# Altium schematic sheet CLK_CDCI6214.SchDoc
size A3; DocumentNumber: 1; SheetNumber: 1; SheetTotal: 5
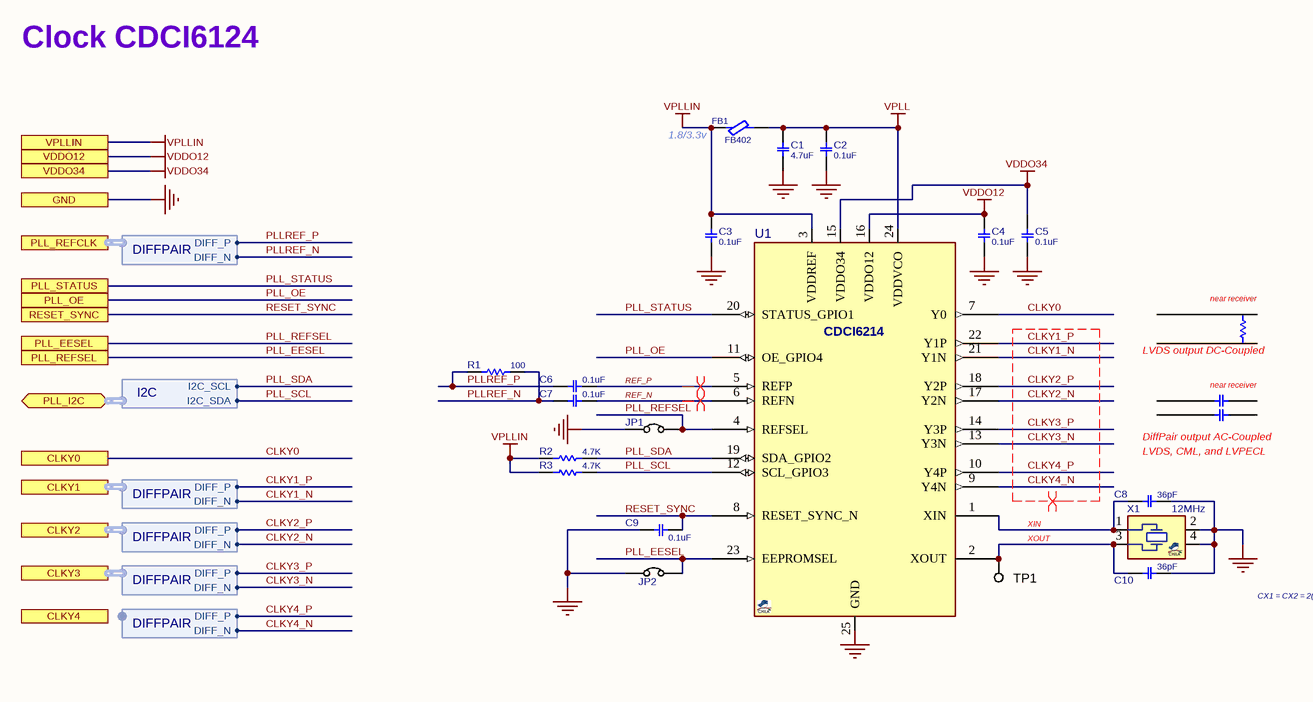
[diagram p0: CLK_CDCI6214.SchDoc]

## Parts
C1  4.7uF  [C0402]
C2  0.1uF  [C0402]
C3  0.1uF  [C0402]
C4  0.1uF  [C0402]
C5  0.1uF  [C0402]
C6  0.1uF  [C0402]
C7  0.1uF  [C0402]
C8  36pF  [C0402]
C9  0.1uF  [C0402]
C10  36pF  [C0402]
FB1  FB402  [L0402]
JP1  JMPSOLDER  [JP_40X50]  (value not drawn)
JP2  JMPSOLDER  [JP_40X50]  (value not drawn)
R1  100  [R0402]
R2  4.7K  [R0402]
R3  4.7K  [R0402]
TP1  TESTPOINT_M_GRN  [TPSMD_C60]  (value not drawn)  (no BOM)
U1  CDCI6214  [QFN50_24T]  (value not drawn)
X1  12MHz  [XTL_4_2520]

## Ports
CLKY0, CLKY1 (harness DIFFPAIR), CLKY2 (harness DIFFPAIR), CLKY3 (harness DIFFPAIR), CLKY4 (harness DIFFPAIR), GND, PLL_EESEL, PLL_I2C (bidir, harness I2C), PLL_OE, PLL_REFCLK (harness DIFFPAIR), PLL_REFSEL, PLL_STATUS, RESET_SYNC, VDDO12, VDDO34, VPLLIN

## Harnesses
DIFFPAIR: DIFF_N, DIFF_P
I2C: I2C_SCL, I2C_SDA

## Nets
GND: C1.2 C2.2 C3.2 C4.2 C5.2 C8.1 C9.2 C10.1 JP1.1 JP2.1 U1.25(GND) X1.2 X1.4 ; port GND
VDDO12: C4.1 U1.16(VDDO12) ; port VDDO12
VDDO34: C5.1 U1.15(VDDO34) ; port VDDO34
VPLL: C1.1 C2.1 FB1.2 U1.24(VDDVCO)
VPLLIN: C3.1 FB1.1 R2.1 R3.1 U1.3(VDDREF) ; port VPLLIN
CLKY0: U1.7(Y0) ; port CLKY0
CLKY1_N: U1.21(Y1N) ; port CLKY1.DIFF_N
CLKY1_P: U1.22(Y1P) ; port CLKY1.DIFF_P
CLKY2_N: U1.17(Y2N) ; port CLKY2.DIFF_N
CLKY2_P: U1.18(Y2P) ; port CLKY2.DIFF_P
CLKY3_N: U1.13(Y3N) ; port CLKY3.DIFF_N
CLKY3_P: U1.14(Y3P) ; port CLKY3.DIFF_P
CLKY4_N: U1.9(Y4N) ; harness DIFFPAIR.DIFF_N
CLKY4_P: U1.10(Y4P) ; harness DIFFPAIR.DIFF_P
PLL_EESEL: JP2.2 U1.23(EEPROMSEL) ; port PLL_REFSEL
PLL_OE: U1.11(OE_GPIO4) ; port PLL_OE
PLL_REFSEL: JP1.2 U1.4(REFSEL) ; port PLL_EESEL
PLL_SCL: R3.2 U1.12(SCL_GPIO3) ; port PLL_I2C.I2C_SDA
PLL_SDA: R2.2 U1.19(SDA_GPIO2) ; port PLL_I2C.I2C_SCL
PLL_STATUS: U1.20(STATUS_GPIO1) ; port PLL_STATUS
PLLREF_N: C7.2 R1.1 ; port PLL_REFCLK.DIFF_N
PLLREF_P: C6.2 R1.2 ; port PLL_REFCLK.DIFF_P
REF_N: C7.1 U1.6(REFN)
REF_P: C6.1 U1.5(REFP)
RESET_SYNC: C9.1 U1.8(RESET_SYNC_N) ; port RESET_SYNC
XIN: C8.2 U1.1(XIN) X1.1
XOUT: C10.2 TP1.1 U1.2(XOUT) X1.3

## Layout directives
differential pair: CLKY1_N, CLKY1_P, CLKY2_N, CLKY2_P, CLKY3_N, CLKY3_P, CLKY4_N, CLKY4_P, REF_N, REF_P

## Notes on the sheet
- Clock CDCI6124
- (near FB1) 1.8/3.3v
- near receiver
- LVDS output DC-Coupled
- DiffPair output AC-Coupled
- (near C8) LVDS, CML, and LVPECL
- (near C10) CX1 = CX2 = 2(CL - Cstray), CS=2pF, CL=20pF

## Library data of the parts
C1 = CAP_SMD_MLCC_4.7u25V: CAP, MLCC, 4.7uF, 25V, X5R, 10%, 0603; DIST#: MOUSER; PARAM: X5R, 10%; MANF: -; ASSEMBLY: ASSEMBLY; PRICE: 100= 14$; PARAM2: 25V; VALUE: 4.7uF; MANF_P#: -
C2-C7 C9 = CAP_SMD_MLCC_100n50T: CAP, MLCC; PARAM: 50V; PARAM2: X5R, 10%; MANF_P#: -; MANF: -; DESC: -; ASSEMBLY: ASSEMBLY; PRICE: 100= 5$; VALUE: 0.1uF
C8 C10 = CAP_SMD_MLCC: CAP, MLCC; PARAM: C0G, ±5%; PARAM2: 50v; PRICE: -; MANF_P#: -; MANF: -; ASSEMBLY: ASSEMBLY; VALUE: 36pF
FB1 = FBEAD_SMD_BLM15PD121: FERRITE_Bead, 0402, 0.5A, 200mOhm, 120@100MHz; MANF: MURATA; MANF_P#: BLM15AG121SN1D; PARAM: 120@100MHz; PARAM2: 0.5A, 200mOhm; VALUE: FB402
JP1 JP2 = JUMPER_SOLDER: JUMPER, HEADER 2PIN; MANF: MANF; MANF_P#: MANF_P#; VALUE: JMPSOLDER
R1-R3 = RES_SMD_10K_0402: RESISTOR, SMD; MANF: Yageo; PARAM: 0.063W; DESC: DESCRIPTION; DIST#: MOUSER; PARAM2: 1%; ASSEMBLY: ASSEMBLY; PRICE: 100= 0.3$; MANF_P#: -
  R1: VALUE: 100
  R2 R3: VALUE: 4.7K
TP1 = TESTPOINT_M_GRN: TEST POINT; MANF: -; MANF_P#: -; VALUE: TESTPOINT
U1 = CDCI6214_QFN24: CLOCK, Generation, 4-output, PCIe Gen4; MANF_P#: CDCI6214RGER; MANF: Texas Instruments; PARAM: 4-OUTPUT, UP to 350MHz; VALUE: CDCI6214
X1 = XTL_4_12MHz_2520: Crystal 12MHz; MANF: JWT; MANF_P#: CM4012M00020T5074172; PARAM: ±30PPM, 20pF; PRICE: 0.05$; VALUE: 12MHz